# Altium schematic sheet Main.SchDoc
size A4
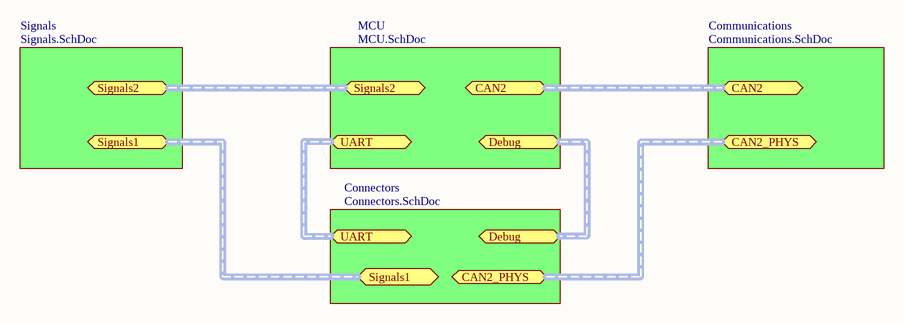
[diagram p0: Main.SchDoc]

## Sub-sheets
Communications = Communications.SchDoc: no entries
Connectors = Connectors.SchDoc: no entries
MCU = MCU.SchDoc: no entries
Signals = Signals.SchDoc: no entries

## Ports
CAN2 (harness CAN), CAN2_PHYS (harness CAN_PHYS), Debug (harness Debug), Signals1 (harness Signals), Signals2 (harness Signals), UART (harness UART)